# Altium project LaptopCharger.PrjPcb
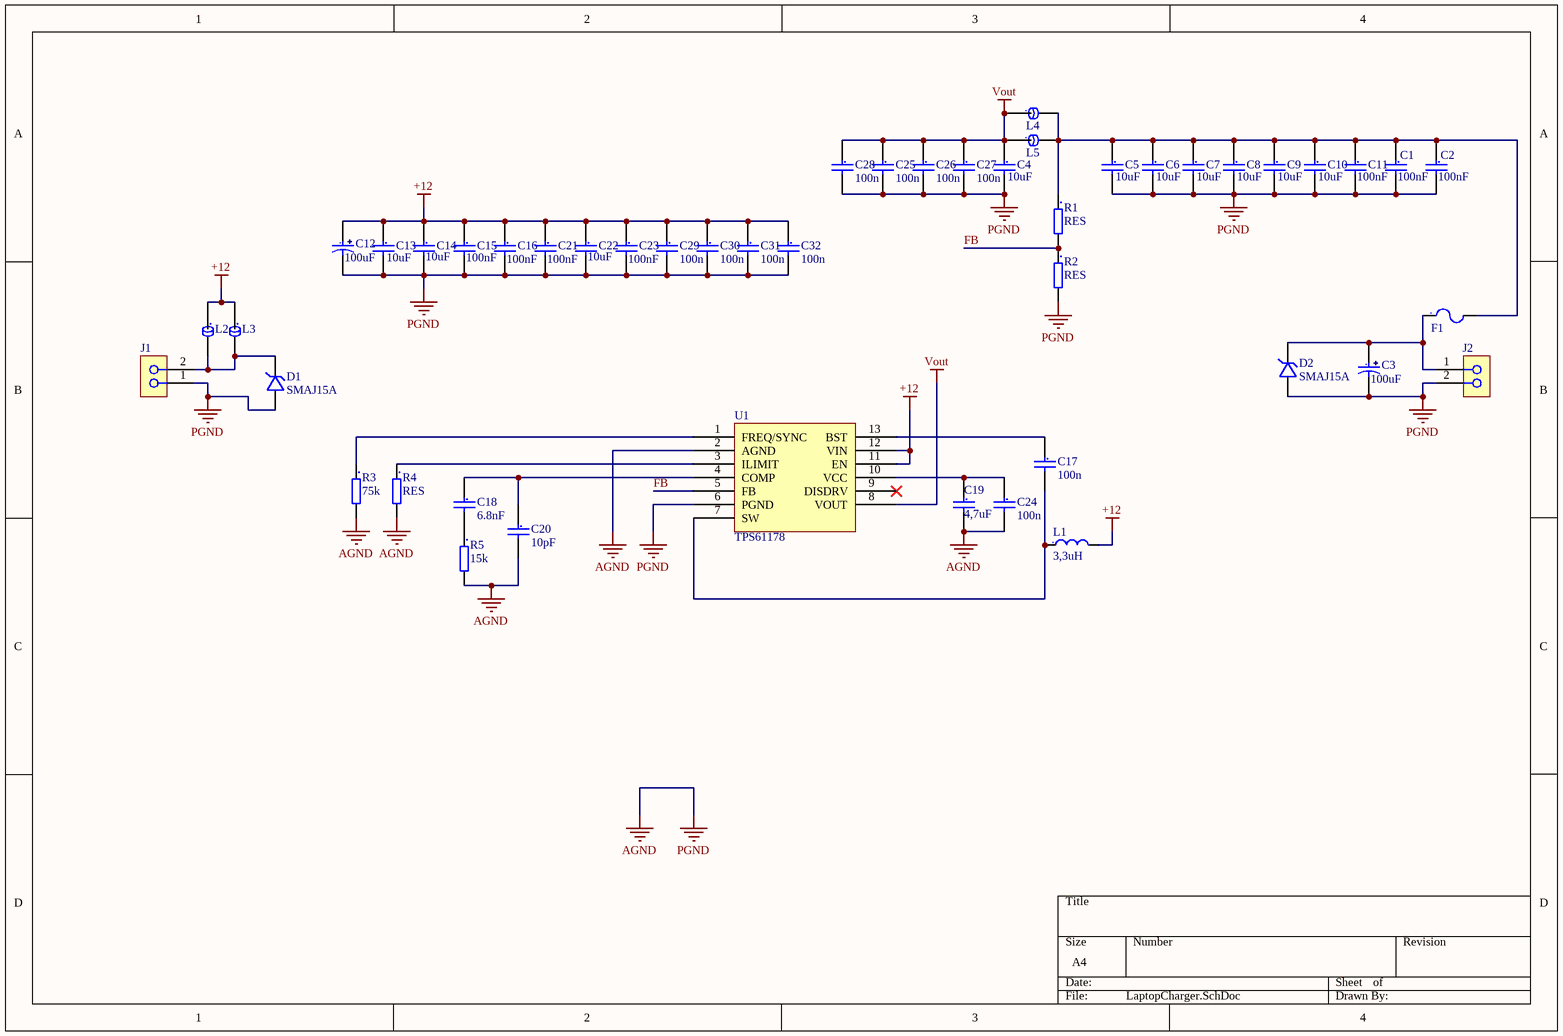
[diagram p0: LaptopCharger.SchDoc]
1 sheet, 48 parts. Net scope: global (net labels, ports and power ports of the same name join across sheets).
Board file: LaptopCharger.PcbDoc

## Sheet LaptopCharger.SchDoc
size A4

### Parts
C1  100nF  [C0603_N]
C2  100nF  [C0603_N]
C3  100uF  [CPE_6.6x6.6x5.4]
C4  10uF  [C0805_N]
C5  10uF  [C0805_N]
C6  10uF  [C0805_N]
C7  10uF  [C0805_N]
C8  10uF  [C0805_N]
C9  10uF  [C0805_N]
C10  10uF  [C0805_N]
C11  100nF  [C0603_N]
C12  100uF  [CPE_6.6x6.6x5.4]
C13  10uF  [C0805_N]
C14  10uF  [C0805_N]
C15  100nF  [C0603_N]
C16  100nF  [C0603_N]
C17  100n  [C0402_N]
C18  6.8nF  [C0603_N]
C19  4,7uF  [C0603_N]
C20  10pF  [C0603_N]
C21  100nF  [C0603_N]
C22  10uF  [C0805_N]
C23  100nF  [C0603_N]
C24  100n  [C0402_N]
C25  100n  [C0402_N]
C26  100n  [C0402_N]
C27  100n  [C0402_N]
C28  100n  [C0402_N]
C29  100n  [C0402_N]
C30  100n  [C0402_N]
C31  100n  [C0402_N]
C32  100n  [C0402_N]
D1  SMAJ15A  [DO-214AC]
D2  SMAJ15A  [DO-214AC]
F1  FUSE  [FUSE1210]  (value not drawn)
J1  (no value)  [CABLE_ENTRY_SCREWLESS_2_45_381]
J2  (no value)  [CABLE_ENTRY_SCREWLESS_2_45_381]
L1  3,3uH  [IND_IDCS-7328]
L2  (no value)  [BEAD_0805_N]
L3  (no value)  [BEAD_0805_N]
L4  (no value)  [BEAD_0805_N]
L5  (no value)  [BEAD_0805_N]
R1  RES  [R0603_N]
R2  RES  [R0603_N]
R3  75k  [R0402_N]
R4  RES  [R0402_N]
R5  15k  [R0603_N]
U1  TPS61178  [VQFN-HR-13]

### Nets
+12: C12.P C13.1 C14.1 C15.1 C16.1 C21.1 C22.1 C23.1 C29.1 C30.1 C31.1 C32.1 L1.2 L2.1 L3.1 U1.11(EN) U1.12(VIN)
AGND: C1.2 C2.2 C3.N C4.2 C5.2 C6.2 C7.2 C8.2 C9.2 C10.2 C11.2 C12.N C13.2 C14.2 C15.2 C16.2 C19.2 C20.2 C21.2 C22.2 C23.2 C24.2 C25.2 C26.2 C27.2 C28.2 C29.2 C30.2 C31.2 C32.2 D1.A D2.A J1.1 J2.2 R2.2 R3.2 R4.2 R5.2 U1.2(AGND) U1.6(PGND)  [also labelled PGND]
Vout: C4.1 C25.1 C26.1 C27.1 C28.1 L4.1 L5.1 U1.8(VOUT)
FB: R1.2 R2.1 U1.5(FB)
NetC1_1: C1.1 C2.1 C5.1 C6.1 C7.1 C8.1 C9.1 C10.1 C11.1 F1.2 L4.2 L5.2 R1.1
NetC3_P: C3.P D2.C F1.1 J2.1
NetC17_1: C17.1 U1.13(BST)
NetC17_2: C17.2 L1.1 U1.7(SW)
NetC18_1: C18.1 C20.1 U1.4(COMP)
NetC18_2: C18.2 R5.1
NetC19_1: C19.1 C24.1 U1.10(VCC)
NetD1_C: D1.C J1.2 L2.2 L3.2
NetR3_1: R3.1 U1.1(FREQ/SYNC)
NetR4_1: R4.1 U1.3(ILIMIT)

Not connected (* = marked no-connect by the designer): U1 9(DISDRV)*

### Library data of the parts
C1 C2 C4-C11 C13-C32 = CAP: RevS: $Rev:: 58        $
C3 C12 = CAP_POL: RevS: $Rev:: 58        $
D1 D2 = DIODE_ZENER
J1 J2 = SOCHDR_2X1: Socket; ComponentLink1Description: Manufacturer; ComponentLink1URL: http://www.we-online.de; ComponentLink2Description: Datasheet; ComponentLink2URL: http://katalog.we-online.de/em/datasheet/691412320002.pdf
L1 = IND: Inductor
L2-L5 = BEAD
R3 R5 = RES
U1 = TPS61178: TPS61178x 20-V, 10-A Fully-Integrated Synchronous Boost with Load Disconnect Control